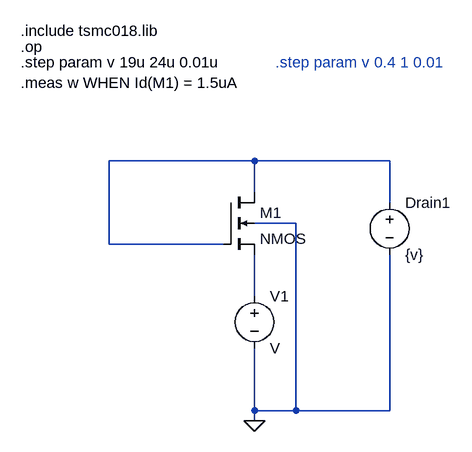
[diagram p0: schematic biasingNmos.asc]
biasingNmos.asc, the LTspice schematic file:
Version 4
SHEET 1 880 680
WIRE 304 144 80 144
WIRE 512 144 304 144
WIRE 304 192 304 144
WIRE 512 208 512 144
WIRE 368 240 304 240
WIRE 80 272 80 144
WIRE 256 272 80 272
WIRE 304 352 304 288
WIRE 304 528 304 432
WIRE 368 528 368 240
WIRE 368 528 304 528
WIRE 512 528 512 288
WIRE 512 528 368 528
WIRE 304 544 304 528
FLAG 304 544 0
SYMBOL cmosn 256 192 R0
SYMATTR InstName M1
SYMATTR Value2 l=0.350u w={w}
SYMATTR Value NMOS
SYMBOL voltage 512 192 R0
WINDOW 123 0 0 Left 0
WINDOW 39 0 0 Left 0
SYMATTR InstName Drain1
SYMATTR Value {v}
SYMBOL voltage 304 336 R0
SYMATTR InstName V1
TEXT -56 -56 Left 2 !.include tsmc018.lib
TEXT -56 -32 Left 2 !.op
TEXT -56 -8 Left 2 !.step param v 19u 24u 0.01u
TEXT -56 24 Left 2 !.meas w WHEN Id(M1) = 1.5uA
TEXT 336 -8 Left 2 ;.step param v 0.4 1 0.01

The netlist it stands for:
* biasingNmos.asc
M1 N001 N001 N002 0 NMOS l=0.350u w={w}
V§Drain1 N001 0 {v}
V1 N002 0 V
.model NMOS NMOS
.model PMOS PMOS
.lib standard.mos
.include tsmc018.lib
.op
.step param v 19u 24u 0.01u
.meas w WHEN Id(M1) = 1.5uA
* .step param v 0.4 1 0.01
.backanno
.end